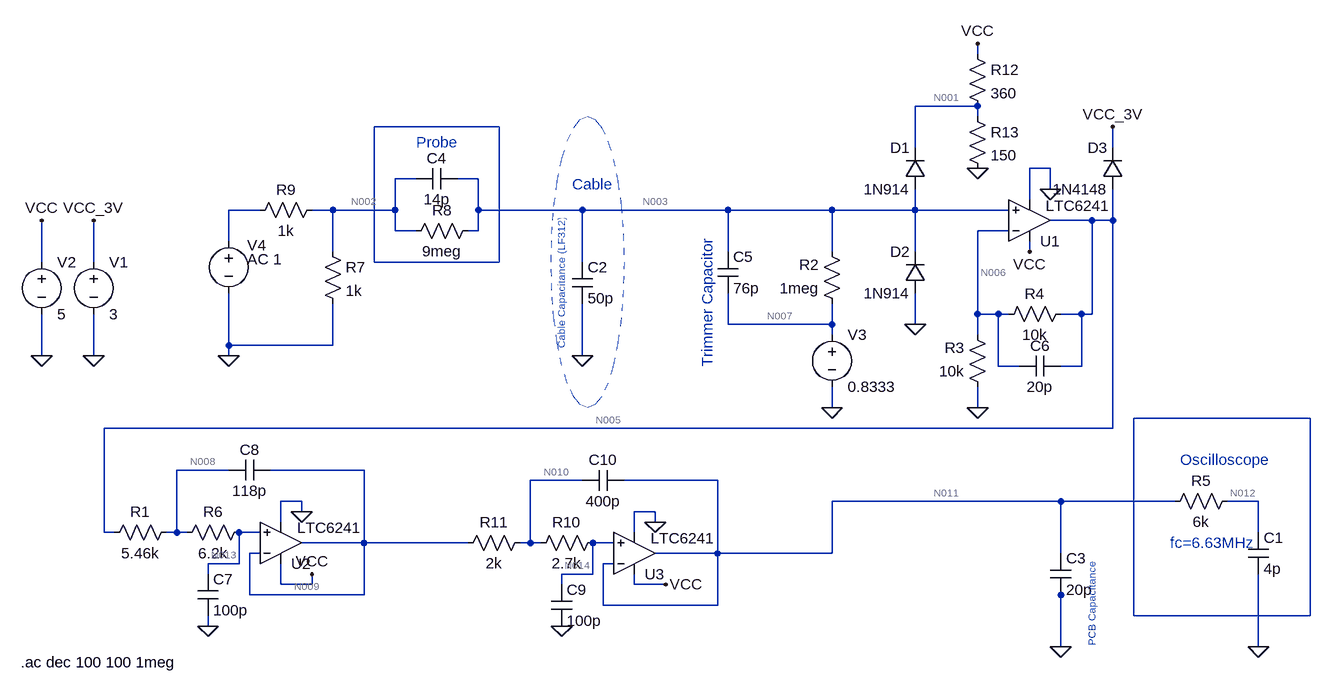
[diagram p0: schematic InputStage2_TimeDomain.asc]
InputStage2_TimeDomain.asc, the LTspice schematic file:
Version 4
SHEET 1 1004 724
WIRE 96 -496 96 -512
WIRE 96 -416 0 -416
WIRE 96 -400 96 -416
WIRE 0 -352 0 -416
WIRE 304 -352 304 -384
WIRE 208 -320 176 -320
WIRE -768 -304 -800 -304
WIRE -672 -304 -704 -304
WIRE 208 -288 208 -320
WIRE 176 -272 176 -320
WIRE -1008 -256 -1056 -256
WIRE -896 -256 -928 -256
WIRE -800 -256 -800 -304
WIRE -800 -256 -896 -256
WIRE -672 -256 -672 -304
WIRE -512 -256 -672 -256
WIRE -288 -256 -512 -256
WIRE -128 -256 -288 -256
WIRE 0 -256 0 -288
WIRE 0 -256 -128 -256
WIRE 144 -256 0 -256
WIRE 272 -240 208 -240
WIRE 304 -240 304 -288
WIRE 304 -240 272 -240
WIRE -800 -224 -800 -256
WIRE -768 -224 -800 -224
WIRE -672 -224 -672 -256
WIRE -672 -224 -688 -224
WIRE 144 -224 96 -224
WIRE -1056 -208 -1056 -256
WIRE -896 -192 -896 -256
WIRE -288 -192 -288 -256
WIRE -128 -192 -128 -256
WIRE 0 -192 0 -256
WIRE 176 -192 176 -208
WIRE -1344 -176 -1344 -240
WIRE -1264 -176 -1264 -240
WIRE -512 -176 -512 -256
WIRE 96 -96 96 -224
WIRE 128 -96 96 -96
WIRE 144 -96 128 -96
WIRE 256 -96 224 -96
WIRE 272 -96 272 -240
WIRE 272 -96 256 -96
WIRE -288 -80 -288 -128
WIRE -128 -80 -128 -112
WIRE -128 -80 -288 -80
WIRE 0 -80 0 -128
WIRE -128 -64 -128 -80
WIRE 96 -64 96 -96
WIRE -1056 -48 -1056 -128
WIRE -896 -48 -896 -112
WIRE -896 -48 -1056 -48
WIRE -1344 -32 -1344 -96
WIRE -1264 -32 -1264 -96
WIRE -1056 -32 -1056 -48
WIRE -512 -32 -512 -112
WIRE 128 -16 128 -96
WIRE 160 -16 128 -16
WIRE 256 -16 256 -96
WIRE 256 -16 224 -16
WIRE -128 48 -128 16
WIRE 96 48 96 16
WIRE 304 80 304 -240
WIRE 304 80 -1248 80
WIRE -1056 144 -1136 144
WIRE -848 144 -992 144
WIRE -512 160 -592 160
WIRE -304 160 -448 160
WIRE -944 192 -976 192
WIRE 224 192 -128 192
WIRE 400 192 224 192
WIRE 528 192 480 192
WIRE -944 208 -944 192
WIRE -400 208 -432 208
WIRE -976 224 -976 192
WIRE -400 224 -400 208
WIRE -1248 240 -1248 80
WIRE -1232 240 -1248 240
WIRE -1136 240 -1136 144
WIRE -1136 240 -1152 240
WIRE -1120 240 -1136 240
WIRE -1008 240 -1040 240
WIRE -432 240 -432 208
WIRE 528 240 528 192
WIRE -848 256 -848 144
WIRE -848 256 -944 256
WIRE -688 256 -848 256
WIRE -592 256 -592 160
WIRE -592 256 -608 256
WIRE -576 256 -592 256
WIRE -464 256 -496 256
WIRE -1008 272 -1024 272
WIRE -304 272 -304 160
WIRE -304 272 -400 272
WIRE -128 272 -128 192
WIRE -128 272 -304 272
WIRE 224 272 224 192
WIRE -1040 288 -1040 240
WIRE -1040 288 -1088 288
WIRE -464 288 -480 288
WIRE -1088 304 -1088 288
WIRE -496 304 -496 256
WIRE -496 304 -544 304
WIRE -976 320 -976 288
WIRE -928 320 -928 304
WIRE -928 320 -976 320
WIRE -544 320 -544 304
WIRE -432 320 -432 304
WIRE -384 320 -432 320
WIRE -1024 336 -1024 272
WIRE -848 336 -848 256
WIRE -848 336 -1024 336
WIRE 224 336 224 320
WIRE -480 352 -480 288
WIRE -304 352 -304 272
WIRE -304 352 -480 352
WIRE -1088 384 -1088 368
WIRE 224 416 224 336
WIRE 528 416 528 304
FLAG 208 -288 0
FLAG -1344 -32 0
FLAG -1344 -240 VCC
FLAG 176 -192 VCC
FLAG 96 48 0
FLAG -128 48 0
FLAG -1056 -32 0
FLAG 528 416 0
FLAG 224 416 0
FLAG -512 -32 0
FLAG -1088 384 0
FLAG -944 208 0
FLAG -928 304 VCC
FLAG -544 384 0
FLAG -400 224 0
FLAG -384 320 VCC
FLAG 0 -80 0
FLAG 96 -512 VCC
FLAG 96 -320 0
FLAG 304 -384 VCC_3V
FLAG -1264 -240 VCC_3V
FLAG -1264 -32 0
SYMBOL Opamps\\LTC6241 176 -240 M180
WINDOW 3 25 23 Left 2
SYMATTR InstName U1
SYMBOL voltage -1344 -192 R0
WINDOW 123 0 0 Left 2
WINDOW 39 0 0 Left 2
SYMATTR InstName V2
SYMATTR Value 5
SYMBOL res 240 -112 R90
WINDOW 0 0 56 VBottom 2
WINDOW 3 32 56 VTop 2
SYMATTR InstName R4
SYMATTR Value 10k
SYMBOL res 112 32 R180
WINDOW 0 36 76 Left 2
WINDOW 3 36 40 Left 2
SYMATTR InstName R3
SYMATTR Value 10k
SYMBOL res -112 -96 R180
WINDOW 0 36 76 Left 2
WINDOW 3 36 40 Left 2
SYMATTR InstName R2
SYMATTR Value 1meg
SYMBOL voltage -128 -80 R0
WINDOW 123 0 0 Left 2
WINDOW 39 0 0 Left 2
SYMATTR InstName V3
SYMATTR Value 0.8333
SYMBOL voltage -1056 -224 R0
WINDOW 0 28 22 Left 2
WINDOW 123 28 44 Left 2
WINDOW 39 0 0 Left 2
WINDOW 3 -72 -64 VRight 2
SYMATTR InstName V4
SYMATTR Value2 AC 1
SYMATTR Value ""
SYMBOL cap 512 240 R0
SYMATTR InstName C1
SYMATTR Value 4p
SYMBOL res 384 208 R270
WINDOW 0 32 56 VTop 2
WINDOW 3 0 56 VBottom 2
SYMATTR InstName R5
SYMATTR Value 6k
SYMBOL cap -528 -176 R0
SYMATTR InstName C2
SYMATTR Value 50p
SYMBOL cap 208 272 R0
SYMATTR InstName C3
SYMATTR Value 20p
SYMBOL res -912 -208 R0
SYMATTR InstName R7
SYMATTR Value 1k
SYMBOL res -784 -208 R270
WINDOW 0 32 56 VTop 2
WINDOW 3 0 56 VBottom 2
SYMATTR InstName R8
SYMATTR Value 9meg
SYMBOL cap -768 -288 R270
WINDOW 0 32 32 VTop 2
WINDOW 3 0 32 VBottom 2
SYMATTR InstName C4
SYMATTR Value 14p
SYMBOL res -1024 -240 R270
WINDOW 0 32 56 VTop 2
WINDOW 3 0 56 VBottom 2
SYMATTR InstName R9
SYMATTR Value 1k
SYMBOL cap -304 -192 R0
SYMATTR InstName C5
SYMATTR Value 76p
SYMBOL cap 224 -32 R90
WINDOW 0 0 32 VBottom 2
WINDOW 3 32 32 VTop 2
SYMATTR InstName C6
SYMATTR Value 20p
SYMBOL Opamps\\LTC6241 -976 256 M180
WINDOW 3 25 23 Left 2
SYMATTR InstName U2
SYMBOL res -1136 224 R90
WINDOW 0 0 56 VBottom 2
WINDOW 3 32 56 VTop 2
SYMATTR InstName R1
SYMATTR Value 5.46k
SYMBOL res -1024 224 R90
WINDOW 0 0 56 VBottom 2
WINDOW 3 32 56 VTop 2
SYMATTR InstName R6
SYMATTR Value 6.2k
SYMBOL cap -1104 304 R0
SYMATTR InstName C7
SYMATTR Value 100p
SYMBOL cap -992 128 R90
WINDOW 0 0 32 VBottom 2
WINDOW 3 32 32 VTop 2
SYMATTR InstName C8
SYMATTR Value 118p
SYMBOL Opamps\\LTC6241 -432 272 M180
WINDOW 3 25 23 Left 2
SYMATTR InstName U3
SYMBOL res -480 240 R90
WINDOW 0 0 56 VBottom 2
WINDOW 3 32 56 VTop 2
SYMATTR InstName R10
SYMATTR Value 2.7k
SYMBOL cap -560 320 R0
SYMATTR InstName C9
SYMATTR Value 100p
SYMBOL cap -448 144 R90
WINDOW 0 0 32 VBottom 2
WINDOW 3 32 32 VTop 2
SYMATTR InstName C10
SYMATTR Value 400p
SYMBOL res -704 272 R270
WINDOW 0 32 56 VTop 2
WINDOW 3 0 56 VBottom 2
SYMATTR InstName R11
SYMATTR Value 2k
SYMBOL diode 16 -288 R180
WINDOW 0 24 64 Left 2
WINDOW 3 24 0 Left 2
SYMATTR InstName D1
SYMATTR Value 1N914
SYMBOL diode 16 -128 R180
WINDOW 0 24 64 Left 2
WINDOW 3 24 0 Left 2
SYMATTR InstName D2
SYMATTR Value 1N914
SYMBOL res 80 -512 R0
SYMATTR InstName R12
SYMATTR Value 360
SYMBOL res 80 -416 R0
SYMATTR InstName R13
SYMATTR Value 150
SYMBOL diode 320 -288 R180
WINDOW 0 24 64 Left 2
WINDOW 3 24 0 Left 2
SYMATTR InstName D3
SYMATTR Value 1N4148
SYMBOL voltage -1264 -192 R0
WINDOW 123 0 0 Left 2
WINDOW 39 0 0 Left 2
SYMATTR InstName V1
SYMATTR Value 3
TEXT 408 128 Left 2 ;Oscilloscope
TEXT -544 -240 VRight 1 ;Cable Capacitance (LF312)
TEXT 272 288 VRight 1 ;PCB Capacitance
TEXT 392 256 Left 2 ;fc=6.63MHz
TEXT -768 -360 Left 2 ;Probe
TEXT -528 -296 Left 2 ;Cable
TEXT -320 -216 VRight 2 ;Trimmer Capacitor
TEXT -1376 440 Left 2 !.ac dec 100 100 1meg
RECTANGLE Normal 608 368 336 64
RECTANGLE Normal -640 -176 -832 -384
CIRCLE Normal -448 48 -560 -400 2

The netlist it stands for:
* InputStage2_TimeDomain.asc
XU1 N003 N006 VCC 0 N005 LTC6241  ; pins In+ In- V+ V- OUT
V2 VCC 0 5
R4 N005 N006 10k
R3 0 N006 10k
R2 N007 N003 1meg
V3 N007 0 0.8333
V4 N004 0 AC 1
C1 N012 0 4p
R5 N011 N012 6k
C2 N003 0 50p
C3 N011 0 20p
R7 N002 0 1k
R8 N002 N003 9meg
C4 N002 N003 14p
R9 N004 N002 1k
C5 N003 N007 76p
C6 N005 N006 20p
XU2 N013 N009 VCC 0 N009 LTC6241  ; pins In+ In- V+ V- OUT
R1 N008 N005 5.46k
R6 N013 N008 6.2k
C7 N013 0 100p
C8 N009 N008 118p
XU3 N014 N011 VCC 0 N011 LTC6241  ; pins In+ In- V+ V- OUT
R10 N014 N010 2.7k
C9 N014 0 100p
C10 N011 N010 400p
R11 N009 N010 2k
D1 N003 N001 1N914
D2 0 N003 1N914
R12 VCC N001 360
R13 N001 0 150
D3 N005 VCC_3V 1N4148
V1 VCC_3V 0 3
.model D D
.lib standard.dio
* Oscilloscope
* Cable Capacitance (LF312)
* PCB Capacitance
* fc=6.63MHz
* Probe
* Cable
* Trimmer Capacitor
.ac dec 100 100 1meg
.lib LTC4.lib
.backanno
.end

* Results of the author's LTspice run, read from the files saved beside the schematic
* Operating Point, zero values left out:
*   V(n005) = 1.5 V
*   V(vcc) = 5 V
*   V(n003) = 750 mV
*   V(n006) = 750 mV
*   V(n007) = 833.3 mV
*   V(n012) = 1.5 V
*   V(n011) = 1.5 V
*   V(n002) = 41.66 µV
*   V(n009) = 1.5 V
*   V(n013) = 1.5 V
*   V(n008) = 1.5 V
*   V(n014) = 1.5 V
*   V(n010) = 1.5 V
*   V(n001) = 1.471 V
*   V(vcc_3v) = 3 V
*   I(D3) = -2.521 nA
*   I(D2) = -2.521 nA
*   I(D1) = -2.521 nA
*   I(R13) = 9.804 mA
*   I(R12) = 9.804 mA
*   I(R9) = -41.66 nA
*   I(R8) = -83.33 nA
*   I(R7) = 41.66 nA
*   I(R2) = 83.32 nA
*   I(R3) = -75 µA
*   I(R4) = 75 µA
*   I(V1) = -2.522 nA
*   I(V4) = 41.66 nA
*   I(V3) = -83.32 nA
*   I(V2) = -15.24 mA
*   Ix(u1:1) = -1.25 pA
*   Ix(u1:2) = -1.25 pA
*   Ix(u1:3) = 1.837 mA
*   Ix(u1:4) = -1.762 mA
*   Ix(u1:5) = -74.99 µA
*   Ix(u2:3) = 1.8 mA
*   Ix(u2:4) = -1.8 mA
*   Ix(u2:5) = 3.6 pA
*   Ix(u3:3) = 1.8 mA
*   Ix(u3:4) = -1.8 mA
*   Ix(u3:5) = 2.8 pA
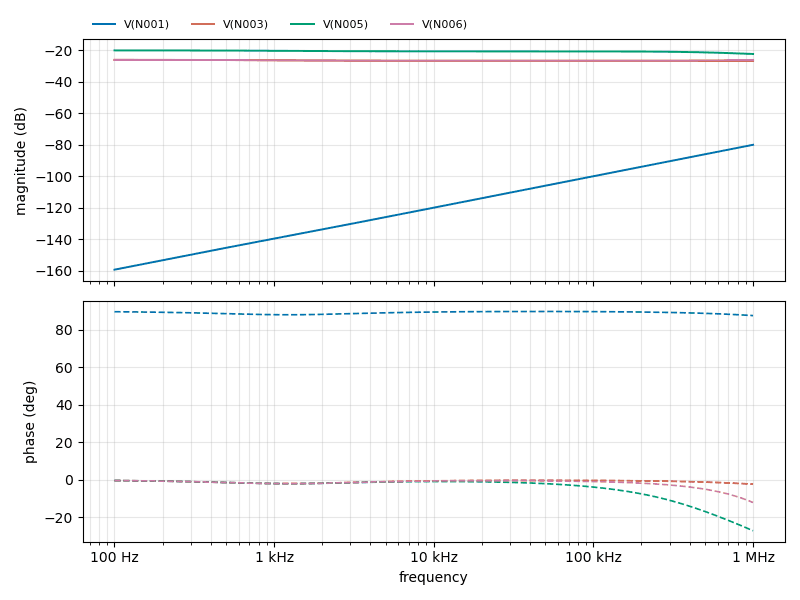
[diagram p1: AC Analysis of InputStage2_TimeDomain.asc, plotted from the saved traces]
* AC Analysis, 1 run:
*   V(N001): -159.41 dB at 100 Hz, -80.01 dB at 1 MHz, peak -80.01 dB at 1 MHz, 3 dB below the peak at 706.8 kHz
*   V(N003): -26.03 dB at 100 Hz, -26.62 dB at 1 MHz, peak -26.03 dB at 100 Hz
*   V(N005): -20.00 dB at 100 Hz, -22.27 dB at 1 MHz, peak -20.00 dB at 100 Hz
*   V(N006): -26.03 dB at 100 Hz, -26.07 dB at 1 MHz, peak -26.03 dB at 100 Hz